# Altium schematic sheet LCD.SchDoc
size A
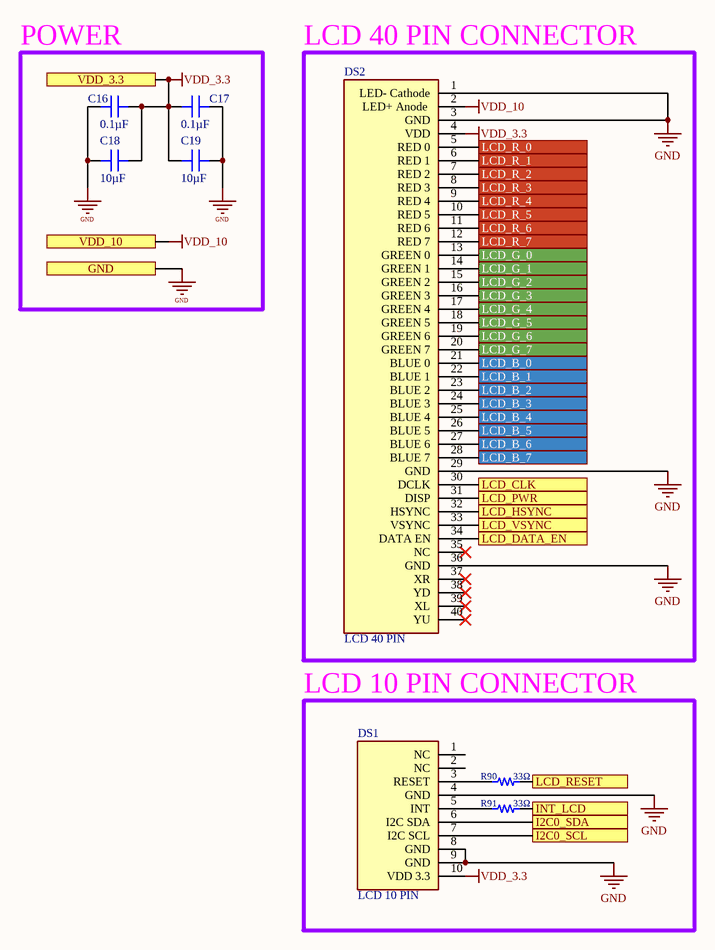
[diagram p0: LCD.SchDoc]

## Parts
C16  0.1µF  [CAP 0603_1608 RF]
C17  0.1µF  [CAP 0603_1608 RF]
C18  10µF  [CAP 0603_1608]
C19  10µF  [CAP 0603_1608]
DS1  LCD 10 PIN  [4DLCD-70800480-CTP-CLB 10 PIN]
DS2  LCD 40 PIN  [4DLCD-70800480-CTP-CLB 40 PIN]
R90  33Ω  [RES 0201_0603]
R91  33Ω  [RES 0201_0603]

## Blocks framed on the sheet
POWER: C16-C19
LCD 40 PIN CONNECTOR: DS2
LCD 10 PIN CONNECTOR: DS1 R90 R91

## Ports
GND, I2C0_SCL, I2C0_SDA, INT_LCD, LCD_B_0, LCD_B_1, LCD_B_2, LCD_B_3, LCD_B_4, LCD_B_5, LCD_B_6, LCD_B_7, LCD_CLK, LCD_DATA_EN, LCD_G_0, LCD_G_1, LCD_G_2, LCD_G_3, LCD_G_4, LCD_G_5, LCD_G_6, LCD_G_7, LCD_HSYNC, LCD_PWR, LCD_R_0, LCD_R_1, LCD_R_2, LCD_R_3, LCD_R_4, LCD_R_5, LCD_R_6, LCD_R_7, LCD_RESET, LCD_VSYNC, VDD_3.3, VDD_10

## Nets
GND: C16.2 C17.1 C18.2 C19.1 DS1.4(GND) DS1.8(GND) DS1.9(GND) DS2.1(LED-_Cathode) DS2.3(GND) DS2.29(GND) DS2.36(GND) ; port GND
VDD_3.3: C16.1 C17.2 C18.1 C19.2 DS1.10(VDD_3.3) DS2.4(VDD) ; port VDD_3.3
VDD_10: DS2.2(LED+_Anode) ; port VDD_10
I2C0_SCL: DS1.7(I2C_SCL) ; port I2C0_SCL
I2C0_SDA: DS1.6(I2C_SDA) ; port I2C0_SDA
INT_LCD: R91.2 ; port INT_LCD
LCD_B_0: DS2.21(BLUE_0) ; port LCD_B_0
LCD_B_1: DS2.22(BLUE_1) ; port LCD_B_1
LCD_B_2: DS2.23(BLUE_2) ; port LCD_B_2
LCD_B_3: DS2.24(BLUE_3) ; port LCD_B_3
LCD_B_4: DS2.25(BLUE_4) ; port LCD_B_4
LCD_B_5: DS2.26(BLUE_5) ; port LCD_B_5
LCD_B_6: DS2.27(BLUE_6) ; port LCD_B_6
LCD_B_7: DS2.28(BLUE_7) ; port LCD_B_7
LCD_CLK: DS2.30(DCLK) ; port LCD_CLK
LCD_DATA_EN: DS2.34(DATA_EN) ; port LCD_DATA_EN
LCD_G_0: DS2.13(GREEN_0) ; port LCD_G_0
LCD_G_1: DS2.14(GREEN_1) ; port LCD_G_1
LCD_G_2: DS2.15(GREEN_2) ; port LCD_G_2
LCD_G_3: DS2.16(GREEN_3) ; port LCD_G_3
LCD_G_4: DS2.17(GREEN_4) ; port LCD_G_4
LCD_G_5: DS2.18(GREEN_5) ; port LCD_G_5
LCD_G_6: DS2.19(GREEN_6) ; port LCD_G_6
LCD_G_7: DS2.20(GREEN_7) ; port LCD_G_7
LCD_HSYNC: DS2.32(HSYNC) ; port LCD_HSYNC
LCD_PWR: DS2.31(DISP) ; port LCD_PWR
LCD_R_0: DS2.5(RED_0) ; port LCD_R_0
LCD_R_1: DS2.6(RED_1) ; port LCD_R_1
LCD_R_2: DS2.7(RED_2) ; port LCD_R_2
LCD_R_3: DS2.8(RED_3) ; port LCD_R_3
LCD_R_4: DS2.9(RED_4) ; port LCD_R_4
LCD_R_5: DS2.10(RED_5) ; port LCD_R_5
LCD_R_6: DS2.11(RED_6) ; port LCD_R_6
LCD_R_7: DS2.12(RED_7) ; port LCD_R_7
LCD_RESET: R90.2 ; port LCD_RESET
LCD_VSYNC: DS2.33(VSYNC) ; port LCD_VSYNC
NetDS1_3: DS1.3(RESET) R90.1
NetDS1_5: DS1.5(INT) R91.1

Not connected (* = marked no-connect by the designer): DS1 1(NC) 2(NC); DS2 35(NC)* 37(XR)* 38(YD)* 39(XL)* 40(YU)*

## Library data of the parts
C16 C17 = CAP00039: CAP CER 0.1UF 16V X7R 0603; Manufacturer: KEMET; Manufacturer P/N: C0603C104M4RACAUTO; Tolerance: ±20%; Device ID: CAP00039; Mounting Type: Surface Mount; Part Type: Capacitor; VALUE: 0.1µF; Operating Temperature: -55°C ~ 125°C; Voltage: 16V; Package: 0603 (1608 Metric); Supplier1: Digi-Key; Supplier1 P/N: 399-C0603C104M4RACAUTOCT-ND; Supplier2: Mouser; Supplier2 P/N: C0603C104M4RACAUTO; Temperature Coefficient: X7R
C18 C19 = CAP00040: CAP CER 010UF 25V X7R 0603; Manufacturer: KEMET; Manufacturer P/N: C0603C273K3RACTU; Tolerance: ±10%; Device ID: CAP00040; Mounting Type: Surface Mount; Part Type: Capacitor; VALUE: 10µF; Operating Temperature: -55°C ~ 125°C; Voltage: 25V; Package: 0603 (1608 Metric); Supplier1: Digi-Key; Supplier1 P/N: 399-7891-1-ND; Supplier2: Mouser; Supplier2 P/N: 80-C0603C273K3R; Temperature Coefficient: X7R
DS1 = LED00009: LED GRN/RED CLEAR 4SMD BOTTOM; Manufacturer: Würth Elektronik; Manufacturer P/N: 156125RV73000; VALUE: LCD DISPLAY; Color: Green/Red; If - Forward Current: 20mA Green, 20mA Red; Vf - Forward Voltage: 2.1V Green, 2V Red; Wavelength: 571nm Green, 624nm Red; Device ID: LED00009; Mounting Type: Ribbon; Part Type: LED; Operating Temperature: -40°C ~ 85°C; Package: 4-SMD; Viewing Angle: -; Lens Color: -; Supplier1: Digi-Key; Supplier1 P/N: 732-11429-1-ND; Supplier2: Mouser; Supplier2 P/N: 710-156125RV73000
DS2 = LED00008: LED GRN/RED CLEAR 4SMD BOTTOM; Manufacturer: Würth Elektronik; Manufacturer P/N: 156125RV73000; VALUE: LCD DISPLAY; Color: Green/Red; If - Forward Current: 20mA Green, 20mA Red; Vf - Forward Voltage: 2.1V Green, 2V Red; Wavelength: 571nm Green, 624nm Red; Device ID: LED00008; Mounting Type: Ribbon; Part Type: LED; Operating Temperature: -40°C ~ 85°C; Package: 4-SMD; Viewing Angle: -; Lens Color: -; Supplier1: Digi-Key; Supplier1 P/N: 732-11429-1-ND; Supplier2: Mouser; Supplier2 P/N: 710-156125RV73000
R90 R91 = RES0003A: RES SMD 33 OHM 1% 1/20W 0201; Manufacturer: Vishay Dale; Manufacturer P/N: CRCW020110R0FNED; Power: 0.050W; Device ID: RES0003A; VALUE: 33Ω; Mounting Type: Surface Mount; Part Type: Resistor; Operating Temperature: -55°C ~ 155°C; Package: 0201 (0603 Metric); Tolerance: ±1%; Composition: Thick Film; Supplier1: Digi-Key; Supplier1 P/N: 541-10.0ABCT-ND; Supplier2: Mouser; Supplier2 P/N: 71-CRCW020110R0FNED